# Altium schematic sheet Blok.SchDoc
size A4
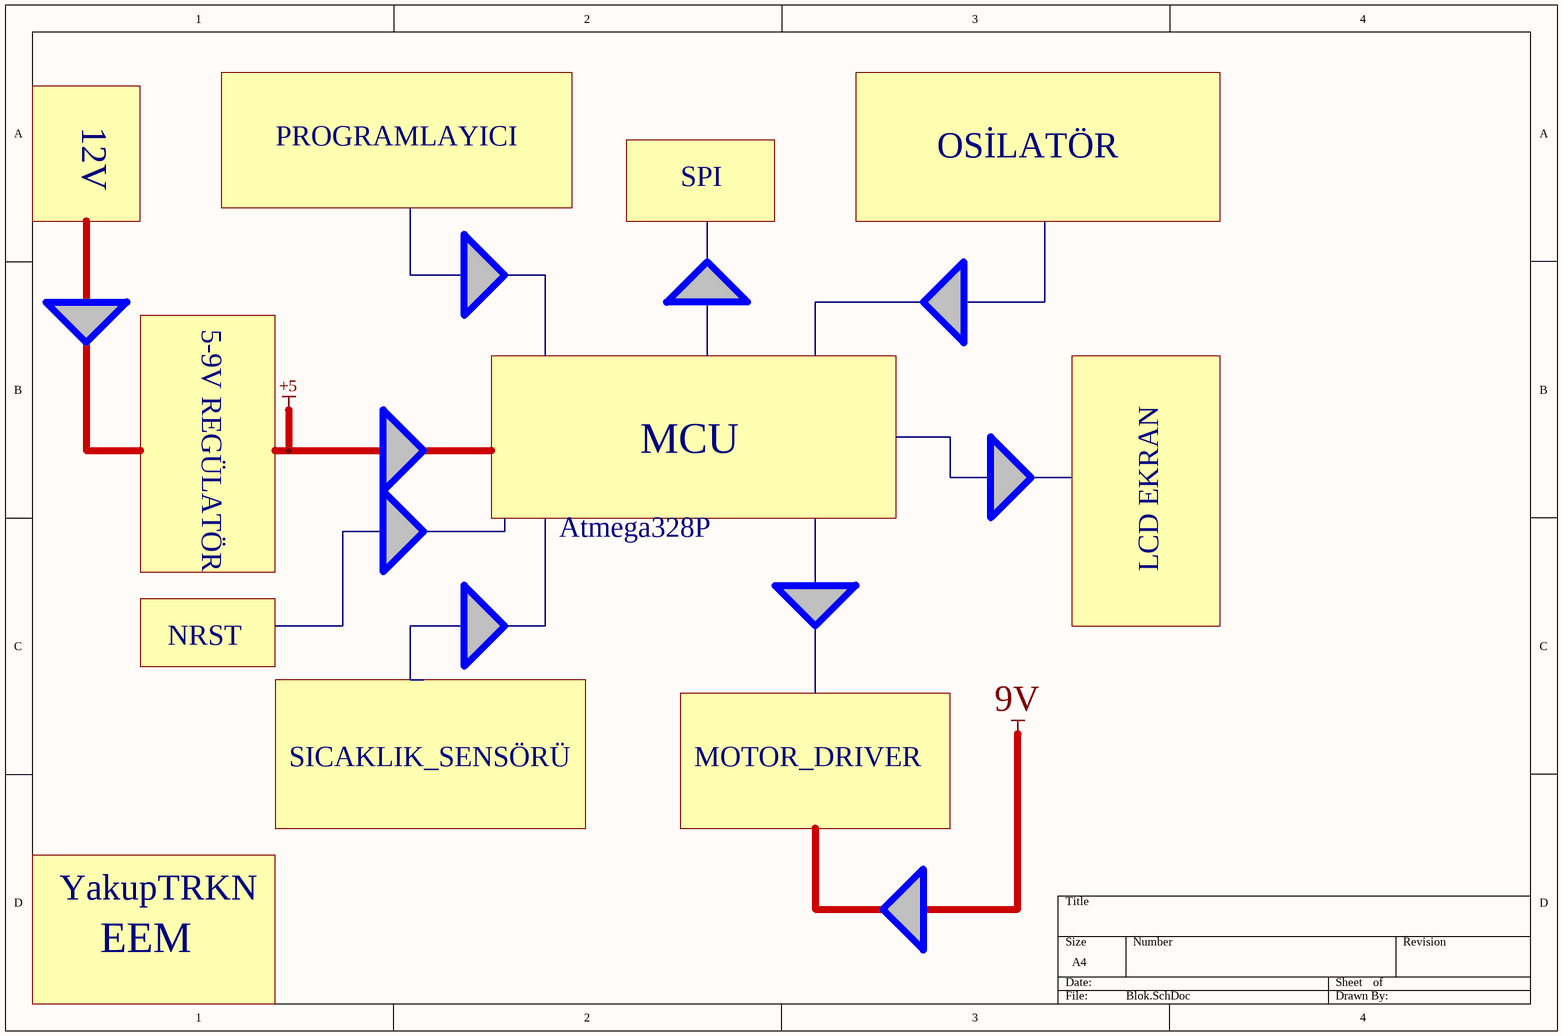
[diagram p0: Blok.SchDoc]

## Notes on the sheet
- 12V
- PROGRAMLAYICI
- OSİLATÖR
- SPI
- 5-9V REGÜLATÖR
- MCU
- Atmega328P
- LCD EKRAN
- NRST
- SICAKLIK_SENSÖRÜ
- MOTOR_DRIVER
- YakupTRKN
- EEM